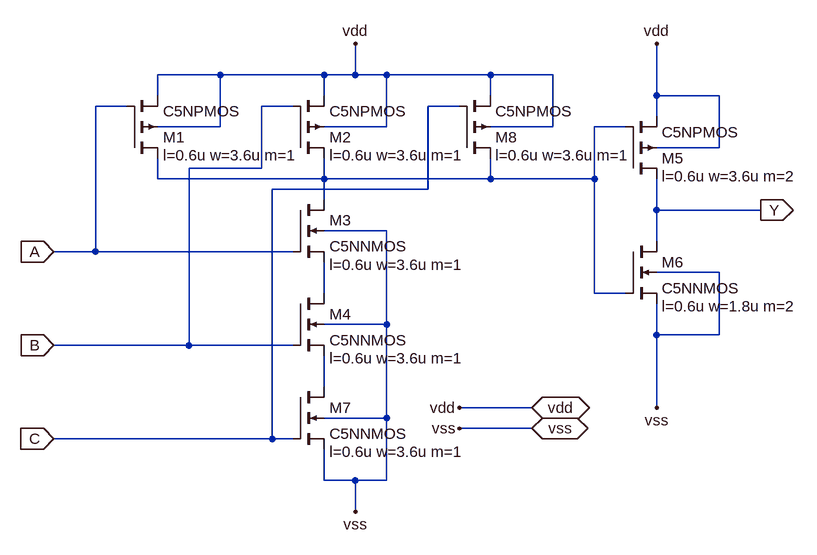
[diagram p0: schematic and3_2x.asc]
and3_2x.asc, the LTspice schematic file:
Version 4
SHEET 1 880 692
WIRE -464 -64 -560 -64
WIRE -304 -64 -464 -64
WIRE -256 -64 -256 -112
WIRE -256 -64 -304 -64
WIRE -208 -64 -256 -64
WIRE -48 -64 -208 -64
WIRE 48 -64 -48 -64
WIRE -560 -32 -560 -64
WIRE -304 -32 -304 -64
WIRE -48 -32 -48 -64
WIRE 208 -32 208 -112
WIRE 304 -32 208 -32
WIRE -608 -16 -656 -16
WIRE -352 -16 -400 -16
WIRE -96 -16 -144 -16
WIRE 208 0 208 -32
WIRE -464 16 -464 -64
WIRE -464 16 -560 16
WIRE -208 16 -208 -64
WIRE -208 16 -304 16
WIRE 48 16 48 -64
WIRE 48 16 -48 16
WIRE 160 16 112 16
WIRE 304 48 304 -32
WIRE 304 48 208 48
WIRE -400 80 -400 -16
WIRE -400 80 -512 80
WIRE -560 96 -560 64
WIRE -304 96 -304 64
WIRE -304 96 -560 96
WIRE -48 96 -48 64
WIRE -48 96 -304 96
WIRE 112 96 112 16
WIRE 112 96 -48 96
WIRE -144 112 -144 -16
WIRE -144 112 -384 112
WIRE -304 128 -304 96
WIRE 208 144 208 96
WIRE 368 144 208 144
WIRE -208 176 -304 176
WIRE 208 192 208 144
WIRE -656 208 -656 -16
WIRE -656 208 -720 208
WIRE -352 208 -656 208
WIRE 304 240 208 240
WIRE -304 272 -304 224
WIRE 112 272 112 96
WIRE 160 272 112 272
WIRE -208 320 -208 176
WIRE -208 320 -304 320
WIRE 208 336 208 288
WIRE 304 336 304 240
WIRE 304 336 208 336
WIRE -512 352 -512 80
WIRE -512 352 -720 352
WIRE -352 352 -512 352
WIRE -304 416 -304 368
WIRE -208 464 -208 320
WIRE 16 448 -96 448
WIRE 208 448 208 336
WIRE -208 464 -304 464
WIRE 16 480 -96 480
WIRE -384 496 -384 112
WIRE -384 496 -720 496
WIRE -352 496 -384 496
WIRE -304 560 -304 512
WIRE -256 560 -304 560
WIRE -208 560 -208 464
WIRE -208 560 -256 560
WIRE -256 608 -256 560
FLAG -720 208 A
IOPIN -720 208 In
FLAG 368 144 Y
IOPIN 368 144 Out
FLAG 208 -112 vdd
FLAG 208 448 vss
FLAG -720 352 B
IOPIN -720 352 In
FLAG 16 448 vdd
IOPIN 16 448 BiDir
FLAG 16 480 vss
IOPIN 16 480 BiDir
FLAG -96 448 vdd
FLAG -96 480 vss
FLAG -256 -112 vdd
FLAG -256 608 vss
FLAG -720 496 C
IOPIN -720 496 In
SYMBOL nmos4 160 192 R0
WINDOW 123 56 100 Left 2
SYMATTR Value2 l=0.6u w=1.8u m=2
SYMATTR InstName M6
SYMATTR Value C5NNMOS
SYMBOL pmos4 160 96 M180
WINDOW 123 56 4 Left 2
SYMATTR Value2 l=0.6u w=3.6u m=2
SYMATTR InstName M5
SYMATTR Value C5NPMOS
SYMBOL pmos4 -608 64 M180
WINDOW 123 56 4 Left 2
SYMATTR Value2 l=0.6u w=3.6u m=1
SYMATTR InstName M1
SYMATTR Value C5NPMOS
SYMBOL pmos4 -352 64 M180
WINDOW 123 56 4 Left 2
SYMATTR Value2 l=0.6u w=3.6u m=1
SYMATTR InstName M2
SYMATTR Value C5NPMOS
SYMBOL nmos4 -352 128 R0
WINDOW 123 56 100 Left 2
SYMATTR Value2 l=0.6u w=3.6u m=1
SYMATTR InstName M3
SYMATTR Value C5NNMOS
SYMBOL nmos4 -352 272 R0
WINDOW 123 56 100 Left 2
SYMATTR Value2 l=0.6u w=3.6u m=1
SYMATTR InstName M4
SYMATTR Value C5NNMOS
SYMBOL nmos4 -352 416 R0
WINDOW 123 56 100 Left 2
SYMATTR Value2 l=0.6u w=3.6u m=1
SYMATTR InstName M7
SYMATTR Value C5NNMOS
SYMBOL pmos4 -96 64 M180
WINDOW 123 56 4 Left 2
SYMATTR Value2 l=0.6u w=3.6u m=1
SYMATTR InstName M8
SYMATTR Value C5NPMOS

The netlist it stands for:
* and3_2x.asc
M6 Y N001 vss vss C5NNMOS l=0.6u w=1.8u m=2
M5 Y N001 vdd vdd C5NPMOS l=0.6u w=3.6u m=2
M1 N001 A vdd vdd C5NPMOS l=0.6u w=3.6u m=1
M2 N001 B vdd vdd C5NPMOS l=0.6u w=3.6u m=1
M3 N001 A N002 vss C5NNMOS l=0.6u w=3.6u m=1
M4 N002 B N003 vss C5NNMOS l=0.6u w=3.6u m=1
M7 N003 C vss vss C5NNMOS l=0.6u w=3.6u m=1
M8 N001 C vdd vdd C5NPMOS l=0.6u w=3.6u m=1
.model NMOS NMOS
.model PMOS PMOS
.lib standard.mos
.backanno
.end